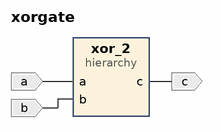
[diagram p0: block diagram of the top level]
# Vivado block design xorgate, xc7z020clg400-1, Vivado 2020.1
create_bd_design xorgate

create_bd_port -dir I a
create_bd_port -dir I b
create_bd_port -dir O c

create_bd_cell -type hier xor_2

# ---- hierarchy /xor_2 ----
current_bd_instance /xor_2
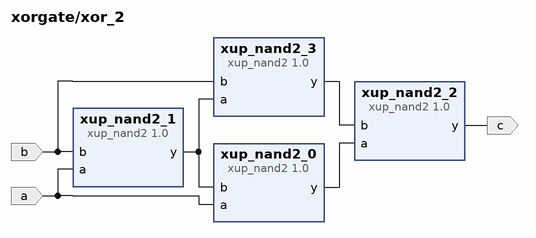
[diagram p1: block diagram inside /xor_2]
create_bd_pin -dir O c
create_bd_pin -dir I b
create_bd_pin -dir I a

create_bd_cell -type ip -vlnv xilinx.com:xup:xup_nand2:1.0 xup_nand2_2
set_property -dict {CONFIG.DELAY 1} [get_bd_cells xup_nand2_2]
create_bd_cell -type ip -vlnv xilinx.com:xup:xup_nand2:1.0 xup_nand2_3
set_property -dict {CONFIG.DELAY 1} [get_bd_cells xup_nand2_3]
create_bd_cell -type ip -vlnv xilinx.com:xup:xup_nand2:1.0 xup_nand2_0
set_property -dict {CONFIG.DELAY 1} [get_bd_cells xup_nand2_0]
create_bd_cell -type ip -vlnv xilinx.com:xup:xup_nand2:1.0 xup_nand2_1
set_property -dict {CONFIG.DELAY 1} [get_bd_cells xup_nand2_1]

# ---- connections ----

current_bd_instance /xor_2
connect_bd_net [get_bd_pins xup_nand2_0/y] [get_bd_pins xup_nand2_2/a]
connect_bd_net [get_bd_pins xup_nand2_3/y] [get_bd_pins xup_nand2_2/b]
connect_bd_net [get_bd_pins xup_nand2_1/y] [get_bd_pins xup_nand2_0/b] [get_bd_pins xup_nand2_3/a]
connect_bd_net [get_bd_pins xup_nand2_2/y] [get_bd_pins c]
connect_bd_net [get_bd_pins b] [get_bd_pins xup_nand2_1/b] [get_bd_pins xup_nand2_3/b]
connect_bd_net [get_bd_pins a] [get_bd_pins xup_nand2_1/a] [get_bd_pins xup_nand2_0/a]

current_bd_instance /
connect_bd_net [get_bd_ports a] [get_bd_pins xor_2/a]
connect_bd_net [get_bd_ports b] [get_bd_pins xor_2/b]
connect_bd_net -net xup_nand2_2_y [get_bd_pins xor_2/c] [get_bd_ports c]

validate_bd_design
save_bd_design
